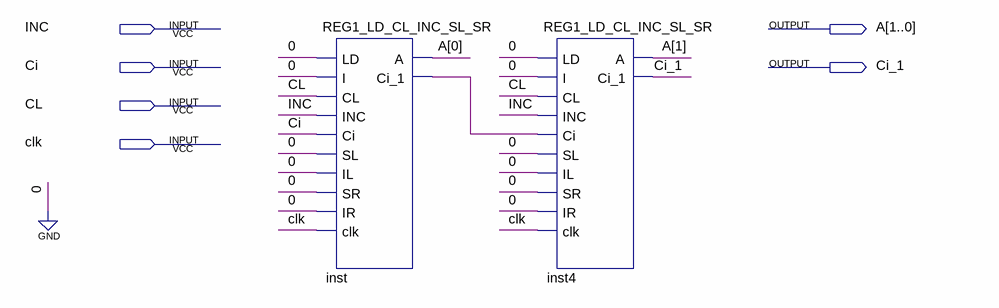
[diagram p0: schematic sheet]
// Quartus schematic REG2_INC_CL.bdf as structural Verilog: 2 symbols, 6 pins
module REG2_INC_CL (
  input  INC,
  input  Ci,
  input  CL,
  input  clk,
  output [1:0] A,
  output Ci_1
);

  wire inst_ci_1;

  REG1_LD_CL_INC_SL_SR inst (
    .LD(1'b0), .I(1'b0), .CL(CL), .INC(INC), .Ci(Ci), .SL(1'b0), .IL(1'b0), .SR(1'b0), .IR(1'b0), .clk(clk),
    .A(A[0]), .Ci_1(inst_ci_1));
  REG1_LD_CL_INC_SL_SR inst4 (
    .LD(1'b0), .I(1'b0), .CL(CL), .INC(INC), .Ci(inst_ci_1), .SL(1'b0), .IL(1'b0), .SR(1'b0), .IR(1'b0),
    .clk(clk), .A(A[1]), .Ci_1(Ci_1));
endmodule
